# Altium project ArduinoMegaDevBoard.PrjPcb
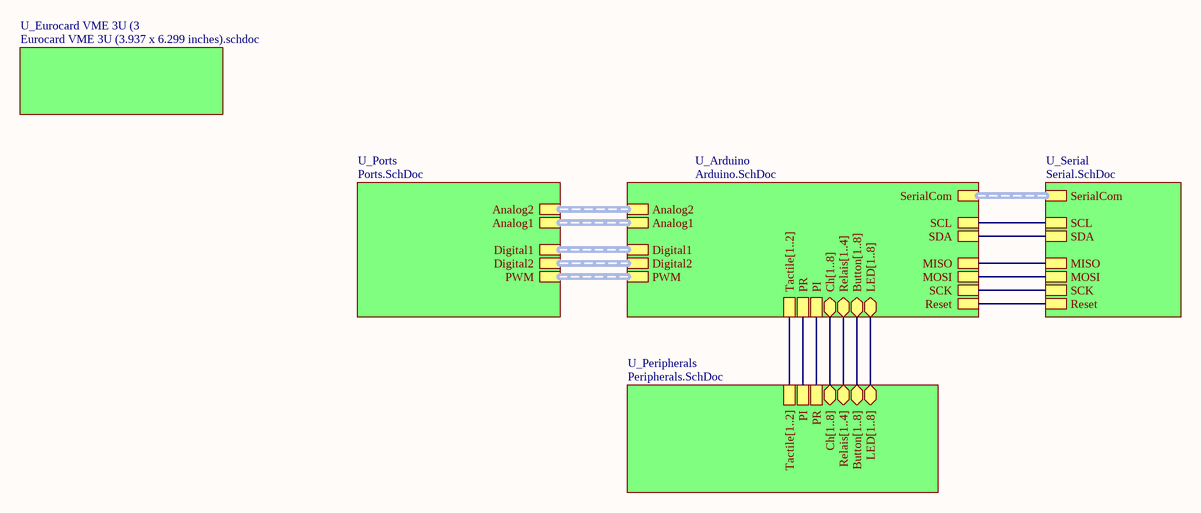
[diagram p0: TopSheet.SchDoc]
6 sheets, 87 parts. Net scope: hierarchical (ports join the sheet entries above them; power ports are global).
Board file: Eurocard VME 3U (3.937 x 6.299 inches).PCBDOC
Sheets:
  TopSheet.SchDoc
    U_Arduino = Arduino.SchDoc
    U_Serial = Serial.SchDoc
    U_Eurocard VME 3U (3 = Eurocard VME 3U (3.937 x 6.299 inches).schdoc
    U_Peripherals = Peripherals.SchDoc
    U_Ports = Ports.SchDoc

## Sheet TopSheet.SchDoc
size A4

### Sub-sheets
U_Arduino = Arduino.SchDoc: SerialCom (harness SerialMC), LED[1..8] (bidir), Button[1..8] (bidir), Relais[1..4] (bidir), PR, PI, Ch[1..8] (bidir), Reset, SCK, MISO, MOSI, Tactile[1..2], Digital1 (harness Digital1), Digital2 (harness Digital2), PWM (harness PWM), Analog2 (harness Analog2), Analog1 (harness Analog1), SCL, SDA
U_Eurocard VME 3U (3 = Eurocard VME 3U (3.937 x 6.299 inches).schdoc: no entries
U_Peripherals = Peripherals.SchDoc: LED[1..8] (bidir), Button[1..8] (bidir), Relais[1..4] (bidir), PI, PR, Ch[1..8] (bidir), Tactile[1..2]
U_Ports = Ports.SchDoc: PWM, Digital1, Digital2, Analog2 (harness Analog2), Analog1 (harness Analog1Port)
U_Serial = Serial.SchDoc: SerialCom (harness Serial3), MISO, Reset, SCK, MOSI, SCL, SDA

### Nets
PI: sheet U_Arduino/PI, sheet U_Peripherals/PR
PR: sheet U_Arduino/PR, sheet U_Peripherals/PI
Relais2: sheet U_Arduino/SCK, sheet U_Serial/SCK
Relais3: sheet U_Arduino/MOSI, sheet U_Serial/MOSI
Relais4: sheet U_Arduino/MISO, sheet U_Serial/MISO
Reset: sheet U_Arduino/Reset, sheet U_Serial/Reset
SCL: sheet U_Arduino/SCL, sheet U_Serial/SCL
SDA: sheet U_Arduino/SDA, sheet U_Serial/SDA

### Buses and harness runs
bus sheet U_Arduino/Button[1..8] = sheet U_Peripherals/Button[1..8]
bus sheet U_Arduino/Ch[1..8] = sheet U_Peripherals/Ch[1..8]
bus sheet U_Arduino/LED[1..8] = sheet U_Peripherals/LED[1..8]
bus sheet U_Arduino/Relais[1..4] = sheet U_Peripherals/Relais[1..4]
bus sheet U_Arduino/Tactile[1..2] = sheet U_Peripherals/Tactile[1..2]
harness sheet U_Arduino/Analog1 = sheet U_Ports/Analog1
harness sheet U_Arduino/Analog2 = sheet U_Ports/Analog2
harness sheet U_Arduino/Digital1 = sheet U_Ports/Digital1
harness sheet U_Arduino/Digital2 = sheet U_Ports/Digital2
harness sheet U_Arduino/PWM = sheet U_Ports/PWM
harness sheet U_Arduino/SerialCom = sheet U_Serial/SerialCom

## Sheet Arduino.SchDoc
size A4
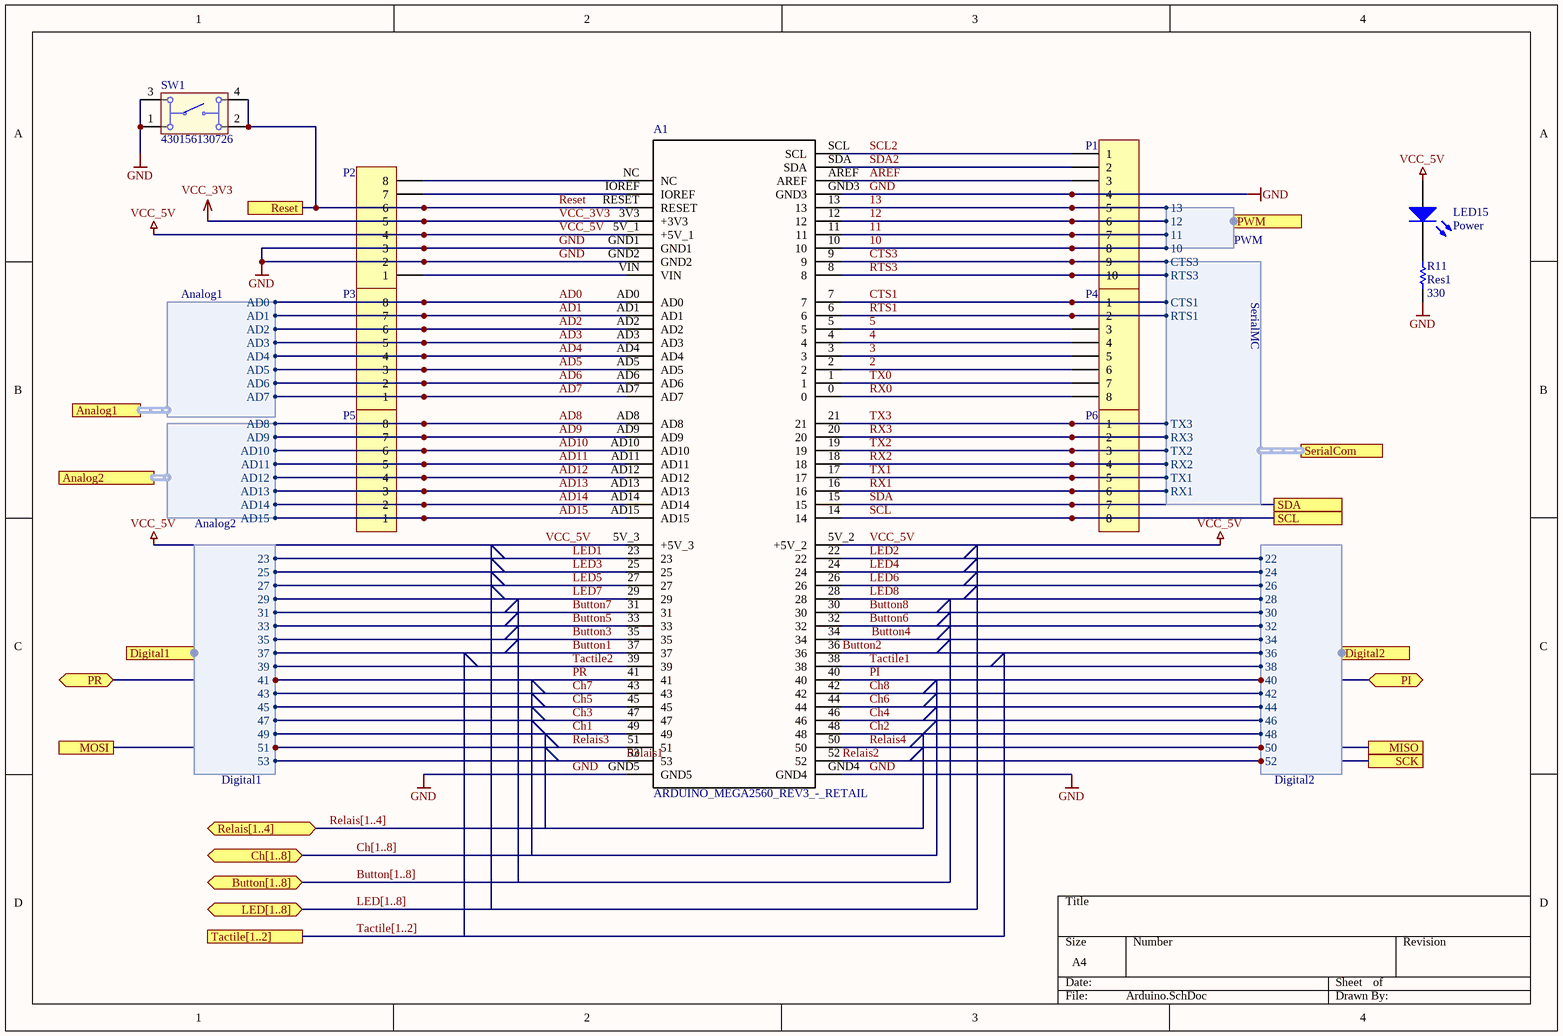
[diagram p1: Arduino.SchDoc]

### Parts
A1  ARDUINO_MEGA2560_REV3_-_RETAIL  [*ARDUINO_MEGA2560_REV3_-_RETAIL_ARDUINO_MEGA2560_REV3_-_RETAIL(Primary)]
LED15  Power  [Type 5mm]
P1  Header 10  [HDR1X10]  (value not drawn)
P2  Header 8  [HDR1X8]  (value not drawn)
P3  Header 8  [HDR1X8]  (value not drawn)
P4  Header 8  [HDR1X8]  (value not drawn)
P5  Header 8  [HDR1X8]  (value not drawn)
P6  Header 8  [HDR1X8]  (value not drawn)
R11  Res1  value 330  [AXIAL-0.3]
SW1  430156130726  [430156130726]

### Ports
Analog1 (harness Analog1), Analog2 (harness Analog2), Button[1..8] (bidir), Ch[1..8] (bidir), Digital1 (harness Digital1), Digital2 (harness Digital2), LED[1..8] (bidir), MISO, MOSI, PI (bidir), PR (bidir), PWM (harness PWM), Relais[1..4] (bidir), Reset, SCK, SCL, SDA, SerialCom (harness SerialMC), Tactile[1..2]

### Harnesses
SerialMC: TX3, RX3, TX2, RX2, TX1, RX1, CTS3, RTS3, CTS1, RTS1
Analog1: AD0, AD1, AD2, AD3, AD4, AD5, AD6, AD7
Digital1: 23, 25, 27, 29, 31, 33, 35, 37, 39, 41, 43, 45, 47, 49, 51, 53
Digital2: 22, 24, 26, 28, 30, 32, 34, 36, 38, 40, 42, 44, 46, 48, 50, 52
PWM: 10, 11, 12, 13
Analog2: AD8, AD9, AD10, AD11, AD12, AD13, AD14, AD15

### Nets
GND: A1.GND1 A1.GND2 A1.GND3 A1.GND4 A1.GND5 P1.4 P2.2 P2.3 R11.1 SW1.1 SW1.3
VCC_3V3: A1.3V3(+3V3) P2.5
VCC_5V: A1.5V_1(+5V_1) A1.5V_2(+5V_2) A1.5V_3(+5V_3) LED15.2(A) P2.4
2: A1.2 P4.6
3: A1.3 P4.5
4: A1.4 P4.4
5: A1.5 P4.3
10: A1.10 P1.8 ; port PWM.10
11: A1.11 P1.7 ; port PWM.11
12: A1.12 P1.6 ; port PWM.12
13: A1.13 P1.5 ; port PWM.13
AD0: A1.AD0 P3.8 ; port Analog1.AD0
AD1: A1.AD1 P3.7 ; port Analog1.AD1
AD2: A1.AD2 P3.6 ; port Analog1.AD2
AD3: A1.AD3 P3.5 ; port Analog1.AD3
AD4: A1.AD4 P3.4 ; port Analog1.AD4
AD5: A1.AD5 P3.3 ; port Analog1.AD5
AD6: A1.AD6 P3.2 ; port Analog1.AD6
AD7: A1.AD7 P3.1 ; port Analog1.AD7
AD8: A1.AD8 P5.8 ; port Analog2.AD8
AD9: A1.AD9 P5.7 ; port Analog2.AD9
AD10: A1.AD10 P5.6 ; port Analog2.AD10
AD11: A1.AD11 P5.5 ; port Analog2.AD11
AD12: A1.AD12 P5.4 ; port Analog2.AD12
AD13: A1.AD13 P5.3 ; port Analog2.AD13
AD14: A1.AD14 P5.2 ; port Analog2.AD14
AD15: A1.AD15 P5.1 ; port Analog2.AD15
AREF: A1.AREF P1.3
Button1: A1.37 ; port Digital1.37
Button2: A1.36 ; port Digital2.36
Button3: A1.35 ; port Digital1.35
Button4: A1.34 ; port Digital2.34
Button5: A1.33 ; port Digital1.33
Button6: A1.32 ; port Digital2.32
Button7: A1.31 ; port Digital1.31
Button8: A1.30 ; port Digital2.30
Ch1: A1.49 ; port Digital1.49
Ch2: A1.48 ; port Digital2.48
Ch3: A1.47 ; port Digital1.47
Ch4: A1.46 ; port Digital2.46
Ch5: A1.45 ; port Digital1.45
Ch6: A1.44 ; port Digital2.44
Ch7: A1.43 ; port Digital1.43
Ch8: A1.42 ; port Digital2.42
CTS1: A1.7 P4.1 ; port SerialCom.CTS1
CTS3: A1.9 P1.9 ; port SerialCom.CTS3
LED1: A1.23 ; port Digital1.23
LED2: A1.22 ; port Digital2.22
LED3: A1.25 ; port Digital1.25
LED4: A1.24 ; port Digital2.24
LED5: A1.27 ; port Digital1.27
LED6: A1.26 ; port Digital2.26
LED7: A1.29 ; port Digital1.29
LED8: A1.28 ; port Digital2.28
PI: A1.40 ; port PI, port Digital2.40
PR: A1.41 ; port PR, port Digital1.41
Relais1: A1.53 ; port Digital1.53
Relais2: A1.52 ; port SCK, port Digital2.52
Relais3: A1.51 ; port MOSI, port Digital1.51
Relais4: A1.50 ; port MISO, port Digital2.50
Reset: A1.RESET P2.6 SW1.2 SW1.4 ; port Reset
RTS1: A1.6 P4.2 ; port SerialCom.RTS1
RTS3: A1.8 P1.10 ; port SerialCom.RTS3
RX0: A1.0 P4.8
RX1: A1.16 P6.6 ; port SerialCom.RX1
RX2: A1.18 P6.4 ; port SerialCom.RX2
RX3: A1.20 P6.2 ; port SerialCom.RX3
SCL: A1.14 P6.8 ; port SCL
SCL2: A1.SCL P1.1
SDA: A1.15 P6.7 ; port SDA
SDA2: A1.SDA P1.2
Tactile1: A1.38 ; port Digital2.38
Tactile2: A1.39 ; port Digital1.39
TX0: A1.1 P4.7
TX1: A1.17 P6.5 ; port SerialCom.TX1
TX2: A1.19 P6.3 ; port SerialCom.TX2
TX3: A1.21 P6.1 ; port SerialCom.TX3
NetA1_IOREF: A1.IOREF P2.7
NetA1_NC: A1.NC P2.8
NetA1_VIN: A1.VIN P2.1
NetLED15_1: LED15.1(K) R11.2

### Buses and harness runs
bus Button[1..8] = port Button[1..8]
bus Ch[1..8] = port Ch[1..8]
bus LED[1..8] =  = port LED[1..8]
bus Relais[1..4] = port Relais[1..4]
bus Tactile[1..2] = port Tactile[1..2]

### Library data of the parts
A1 = ARDUINO_MEGA2560_REV3_-_RETAIL: Dev.kit: Arduino; SPI, TWI, UART; ICSP, USB B, pin strips, supply; MP: ARDUINO MEGA2560 REV3 - RETAIL; Price: None; MF: Arduino; Package: None; Availability: Unavailable; SnapEDA_Link: https://www.snapeda.com/parts/ARDUINO%20MEGA2560%20REV3%20-%20RETAIL/Arduino/view-part/?ref=snap; Value: *
LED15 = CMP-1489-00005-1: THT LED round mono-color waterclear, WL-TMRW, Green; PartNumber: 151053GS03000; Manufacturer: Wuerth Elektronik; ComponentLink2URL: http://katalog.we-online.de/pbs/datasheet/7448042001.pdfhttp://katalog.we-online.de/pbs/datasheet/7448042001.pdfhttp://katalog.we-online.de/pbs/datasheet/7448042001.pdfhttp://katalog.we-online.de/pbs/datasheet/151053GS03000.pdf; ComponentLink2Description: Datasheet; ComponentLink1URL: http://www.we-online.com; PackageReference: Type 5mm; ComponentLink1Description: Manufacturer URL; Emitting color: Green
P1 = Header 10: Header, 10-Pin; LatestRevisionDate: 17-Jul-2002; LatestRevisionNote: Re-released for DXP Platform.; Publisher: Altium Limited
P2-P6 = Header 8: Header, 8-Pin; LatestRevisionDate: 17-Jul-2002; LatestRevisionNote: Re-released for DXP Platform.; Publisher: Altium Limited
R11 = Res1: Resistor; Published: 8-Jun-2000; LatestRevisionDate: 17-Jul-2002; LatestRevisionNote: Re-released for DXP Platform.; PackageReference: AXIAL-0.3; Publisher: Altium Limited; PackageDescription: Axial Device, Thru-Hole; 2 Leads; 0.3 in Pin Spacing
SW1 = CMP-1453-00009-1: WS-TATV THT Tact Switch 6X6 mm; Manufacturer: Wuerth Elektronik; NoPins: 04; PartNumber: 430156130726; ComponentLink1Description: Manufacturer URL; ComponentLink1URL: http://www.we-online.com; ComponentLink2Description: Datasheet; ComponentLink2URL: http://katalog.we-online.de/em/datasheet/4301x6.pdf; PackageReference: 430156130726

## Sheet Serial.SchDoc
size A4
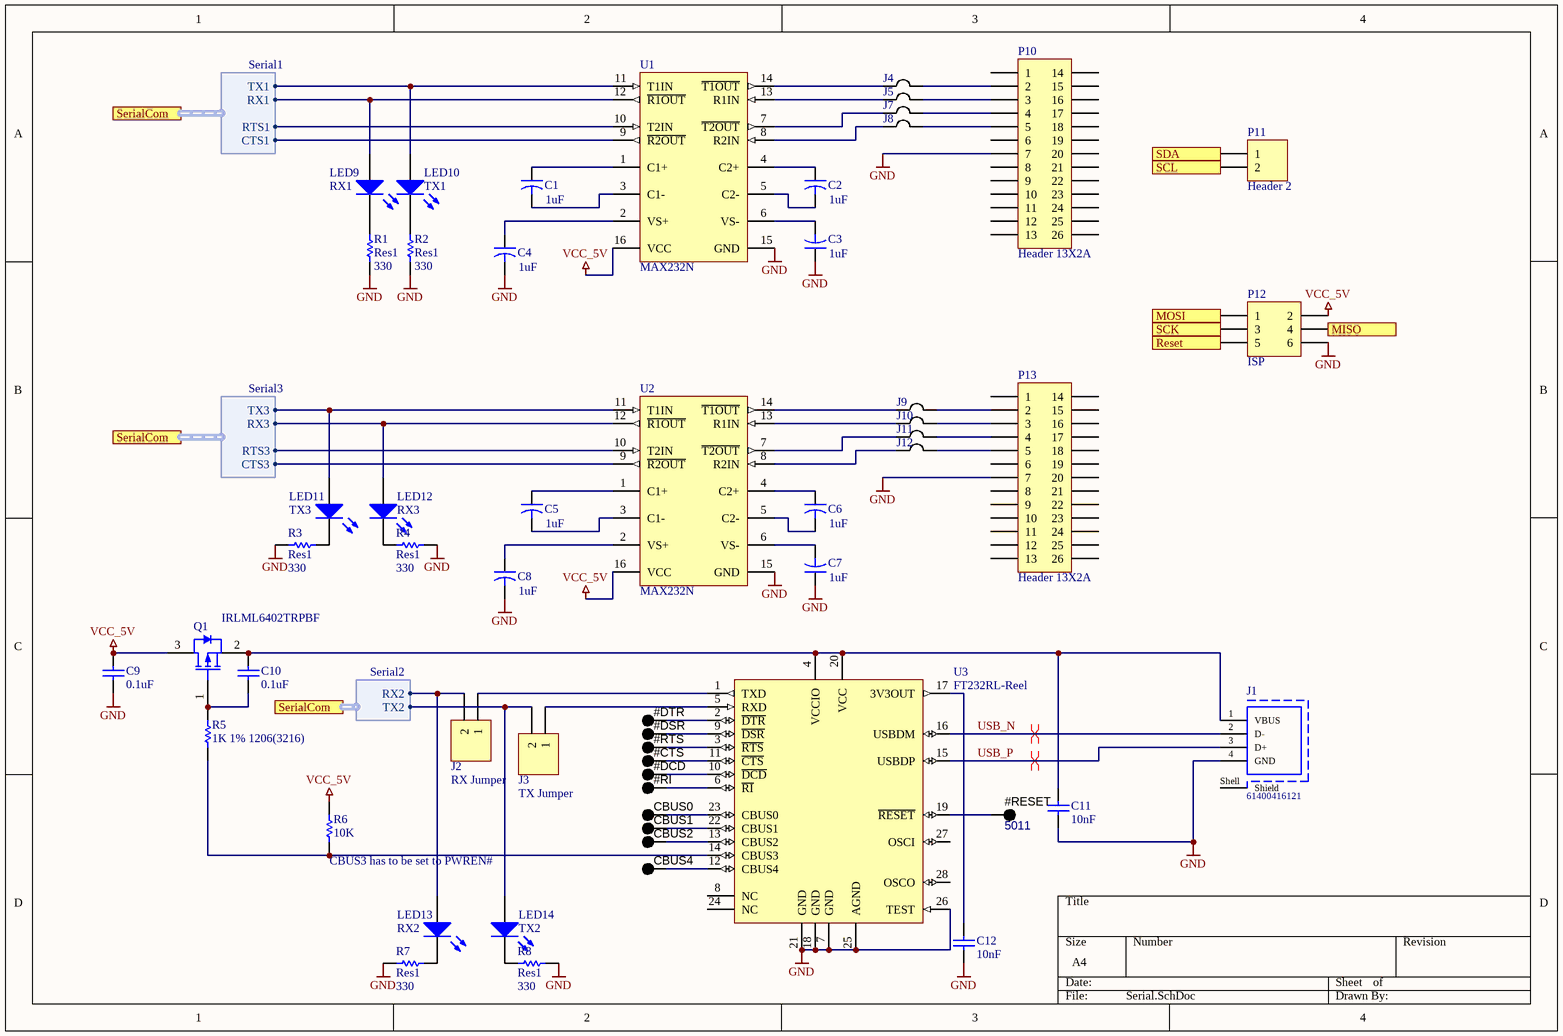
[diagram p2: Serial.SchDoc]

### Parts
(Parts that share a designator on the sheet are numbered #1, #2 ... from top to bottom, then left to right.)
#CTS  5011  [KSTN-5011_V]  (value not drawn)
#DCD  5011  [KSTN-5011_V]  (value not drawn)
#DSR  5011  [KSTN-5011_V]  (value not drawn)
#DTR  5011  [KSTN-5011_V]  (value not drawn)
#RESET  5011  [KSTN-5011_V]
#RI  5011  [KSTN-5011_V]  (value not drawn)
#RTS  5011  [KSTN-5011_V]  (value not drawn)
C1  value 1uF  [CAPR5-4X5]  (hidden comment: Cap2)
C2  value 1uF  [CAPR5-4X5]  (hidden comment: Cap2)
C3  value 1uF  [CAPR5-4X5]  (hidden comment: Cap2)
C4  value 1uF  [CAPR5-4X5]  (hidden comment: Cap2)
C5  value 1uF  [CAPR5-4X5]  (hidden comment: Cap2)
C6  value 1uF  [CAPR5-4X5]  (hidden comment: Cap2)
C7  value 1uF  [CAPR5-4X5]  (hidden comment: Cap2)
C8  value 1uF  [CAPR5-4X5]  (hidden comment: Cap2)
C9  0.1uF  [CAPC1206(3216)130_L]
C10  0.1uF  [CAPC1206(3216)130_L]
C11  10nF  [CAPC1206(3216)130_M]
C12  10nF  [CAPC1206(3216)130_M]
CBUS0  5011  [KSTN-5011_V]  (value not drawn)
CBUS1  5011  [KSTN-5011_V]  (value not drawn)
CBUS2  5011  [KSTN-5011_V]  (value not drawn)
CBUS4  5011  [KSTN-5011_V]  (value not drawn)
J1  61400416121  [61400416121]
J2  RX Jumper  [HDR1X2]
J3  TX Jumper  [HDR1X2]
J4#1  Jumper  [SMDJumper]  (value not drawn)
J5#1  Jumper  [SMDJumper]  (value not drawn)
J7  Jumper  [SMDJumper]  (value not drawn)
J8  Jumper  [SMDJumper]  (value not drawn)
J9  Jumper  [SMDJumper]  (value not drawn)
J10  Jumper  [SMDJumper]  (value not drawn)
J11  Jumper  [SMDJumper]  (value not drawn)
J12  Jumper  [SMDJumper]  (value not drawn)
LED9  RX1  [Type 3mm]
LED10  TX1  [Type 3mm]
LED11  TX3  [Type 3mm]
LED12  RX3  [Type 3mm]
LED13  RX2  [Type 3mm]
LED14  TX2  [Type 3mm]
P10  Header 13X2A  [HDR2X13_CEN]
P11  Header 2  [HDR1X2]
P12  ISP  [HDR2X3]
P13  Header 13X2A  [HDR2X13_CEN]
Q1  IRLML6402TRPBF  [INTR-SOT-23-3_V]
R1  Res1  value 330  [AXIAL-0.3]
R2  Res1  value 330  [AXIAL-0.3]
R3  Res1  value 330  [AXIAL-0.3]
R4  Res1  value 330  [AXIAL-0.3]
R5  1K 1% 1206(3216)  [RESC1206(3216)_N]
R6  10K  [RESC1206(3216)_M]
R7  Res1  value 330  [AXIAL-0.3]
R8  Res1  value 330  [AXIAL-0.3]
U1  MAX232N  [N0016A]
U2  MAX232N  [N0016A]
U3  FT232RL-Reel  [SSOP-28_M]

### Ports
MISO, MOSI, Reset, SCK, SCL, SDA, SerialCom (harness Serial1), SerialCom (harness Serial2), SerialCom (harness Serial3)

### Harnesses
Serial1: TX1, RX1, CTS1, RTS1
Serial2: TX2, RX2
Serial3: TX3, RX3, CTS3, RTS3

### Nets
GND: C3.1 C4.2 C7.1 C8.2 C9.2 C11.1 C12.1 J1.4(GND) P10.7 P12.6 P13.7 R1.1 R2.1 R3.1 R4.2 R7.1 R8.2 U1.15(GND) U2.15(GND) U3.7(GND) U3.18(GND) U3.21(GND) U3.25(AGND) U3.26(TEST)
VCC_5V: C9.1 P12.2 Q1.3(DRAIN) R6.2 U1.16(VCC) U2.16(VCC)
CTS1: U1.9(~{R2OUT}) ; port SerialCom.CTS1
CTS3: U2.9(~{R2OUT}) ; port SerialCom.CTS3
Relais2: P12.3 ; port SCK
Relais3: P12.1 ; port MOSI
Relais4: P12.4 ; port MISO
Reset: P12.5 ; port Reset
RTS1: U1.10(T2IN) ; port SerialCom.RTS1
RTS3: U2.10(T2IN) ; port SerialCom.RTS3
RX1: LED9.2(A) U1.12(~{R1OUT}) ; port SerialCom.RX1
RX2: J2.2 LED13.2(A) ; port SerialCom.RX2
RX3: LED12.2(A) U2.12(~{R1OUT}) ; port SerialCom.RX3
SCL: P11.2 ; port SCL
SDA: P11.1 ; port SDA
TX1: LED10.2(A) U1.11(T1IN) ; port SerialCom.TX1
TX2: J3.2 LED14.2(A) ; port SerialCom.TX2
TX3: LED11.2(A) U2.11(T1IN) ; port SerialCom.TX3
USB_N: J1.2(D-) U3.16(USBDM)
USB_P: J1.3(D+) U3.15(USBDP)
Net#CTS_1: #CTS.1 U3.11(~{CTS})
Net#DCD_1: #DCD.1 U3.10(~{DCD})
Net#DSR_1: #DSR.1 U3.9(~{DSR})
Net#DTR_1: #DTR.1 U3.2(~{DTR})
Net#RESET_1: #RESET.1 U3.19(~{RESET})
Net#RI_1: #RI.1 U3.6(~{RI})
Net#RTS_1: #RTS.1 U3.3(~{RTS})
NetC1_1: C1.1 U1.1(C1+)
NetC1_2: C1.2 U1.3(C1-)
NetC2_1: C2.1 U1.4(C2+)
NetC2_2: C2.2 U1.5(C2-)
NetC3_2: C3.2 U1.6(VS-)
NetC4_1: C4.1 U1.2(VS+)
NetC5_1: C5.1 U2.1(C1+)
NetC5_2: C5.2 U2.3(C1-)
NetC6_1: C6.1 U2.4(C2+)
NetC6_2: C6.2 U2.5(C2-)
NetC7_2: C7.2 U2.6(VS-)
NetC8_1: C8.1 U2.2(VS+)
NetC10_1: C10.1 C11.2 J1.1(VBUS) Q1.2(SOURCE) U3.4(VCCIO) U3.20(VCC)
NetC10_2: C10.2 Q1.1(GATE) R5.2
NetC12_2: C12.2 U3.17(3V3OUT)
NetCBUS0_1: CBUS0.1 U3.23(CBUS0)
NetCBUS1_1: CBUS1.1 U3.22(CBUS1)
NetCBUS2_1: CBUS2.1 U3.13(CBUS2)
NetCBUS4_1: CBUS4.1 U3.12(CBUS4)
NetJ2_1: J2.1 U3.1(TXD)
NetJ3_1: J3.1 U3.5(RXD)
NetJ4#1_1: J4#1.1 U1.14(~{T1OUT})
NetJ4#1_2: J4#1.2 P10.2
NetJ5#1_1: J5#1.1 U1.13(R1IN)
NetJ5#1_2: J5#1.2 P10.3
NetJ7_1: J7.1 U1.7(~{T2OUT})
NetJ7_2: J7.2 P10.4
NetJ8_1: J8.1 U1.8(R2IN)
NetJ8_2: J8.2 P10.5
NetJ9_1: J9.1 U2.14(~{T1OUT})
NetJ9_2: J9.2 P13.2
NetJ10_1: J10.1 U2.13(R1IN)
NetJ10_2: J10.2 P13.3
NetJ11_1: J11.1 U2.7(~{T2OUT})
NetJ11_2: J11.2 P13.4
NetJ12_1: J12.1 U2.8(R2IN)
NetJ12_2: J12.2 P13.5
NetLED9_1: LED9.1(K) R1.2
NetLED10_1: LED10.1(K) R2.2
NetLED11_1: LED11.1(K) R3.2
NetLED12_1: LED12.1(K) R4.1
NetLED13_1: LED13.1(K) R7.2
NetLED14_1: LED14.1(K) R8.1
NetR5_1: R5.1 R6.1 U3.14(CBUS3)

Not connected (* = marked no-connect by the designer): J1 Shell(Shield); P10 1 6 8 9 10 11 12 13 14 15 16 17 18 19 20 21 22 23 24 25 26; P13 1 6 8 9 10 11 12 13 14 15 16 17 18 19 20 21 22 23 24 25 26; U3 8(NC) 24(NC) 27(OSCI) 28(OSCO)

### Layout directives
differential pair; net class USB_N: USB_N
differential pair: USB_P

### Notes on the sheet
- (near R6) CBUS3 has to be set to PWREN#

### Library data of the parts
#CTS #DCD #DSR #DTR #RESET #RI #RTS CBUS0-CBUS2 CBUS4 = CMP-1672-00003-3: Test Point, Black, Through Hole, RoHS, Bulk; Contact Plating: Silver; Packaging: Bulk; Package Quantity: 100; REACH SVHC: No SVHC; PackageDescription: 1-Pin Through Hole Device, Dia 3.17 mm; PackageReference: 5011; Colour: Black; Mount: Through Hole; Mounting Technology: Through Hole; Pins: 1; RoHSCompliant: true; Height: 8.12 mm; Contact Material: Bronze; DatasheetVersion: Rev. F, 12/2013
C1-C8 = Cap2: Capacitor; Published: 23-Sep-2002; PackageReference: CAPR5-4X5; Publisher: Altium Limited; PackageDescription: Capacitor; 2 Leads
C9-C12 = CMP-1037-03460-1: CAP 10nF 16V ±1% 1206 (3216 Metric) Thickness 1.3mm SMD; Case-Metric: 3216; Tolerance: Â±1%; Case-EIA: 1206; Max Thickness: 1.3 mm; Technology: SMT; Rated Voltage: 16 V
  C9 C10: Value: 0.1uF
  C11 C12: Value: 10nF
J1 = CMP-1502-03243-1: USB 2.0 Type B Receptacle WR-COM, Horizontal, THT, with Pads and Pegs; Manufacturer: Wurth Elektronik; Contact Resistance: 20mOhm; Rated Current: 1.5A; Working Voltage: 30VAC; Package Reference: 61400416121; Part Number: 61400416121; Packaging: Tray; Mounting Technology: THT; Gender: Receptacle; Datasheet URL: https://katalog.we-online.de/em/datasheet/61400416121.pdf; Publisher: WurthElektronik; Orientation: Horizontal; Connector Type: USB2.0TypeB; Operating Temperature: -40to105degC; Manufacturer URL: http://www.we-online.de
J2 J3 P11 = Header 2: Header, 2-Pin; LatestRevisionDate: 17-Jul-2002; LatestRevisionNote: Re-released for DXP Platform.; Publisher: Altium Limited
LED9-LED14 = CMP-1489-00003-1: THT LED round mono-color waterclear, WL-TMRW, Yellow; Manufacturer: Wuerth Elektronik; PartNumber: 151033YS03000; ComponentLink2Description: Datasheet; ComponentLink1Description: Manufacturer URL; Emitting color: Yellow; ComponentLink2URL: http://katalog.we-online.de/pbs/datasheet/7448042001.pdfhttp://katalog.we-online.de/pbs/datasheet/7448042001.pdfhttp://katalog.we-online.de/pbs/datasheet/7448042001.pdfhttp://katalog.we-online.de/pbs/datasheet/151033YS03000.pdf; ComponentLink1URL: http://www.we-online.com; PackageReference: Type 3mm
P10 P13 = Header 13X2A: Header, 13-Pin, Dual row; LatestRevisionDate: 17-Jul-2002; LatestRevisionNote: Re-released for DXP Platform.; Publisher: Altium Limited
P12 = Header 3X2: Header, 3-Pin, Dual row; LatestRevisionDate: 17-Jul-2002; LatestRevisionNote: Re-released for DXP Platform.; Publisher: Altium Limited
Q1 = CMP-2000-04987-1: HEXFET(R) Power P-Channel MOSFET, -20 V, -3.7 A, -55 to 150 degC, 3-Pin SOT-23, RoHS, Tape and Reel; Manufacturer: International Rectifier; Drain-to-Source Voltage [Vdss]: 20V; Rated Power Dissipation: 1.3W; Qg Gate Charge: 8nC; Drain-Source On Resistance-Max: 0.065O; Channel Type: P-Channel; Package Reference: SOT-23-3; Manufacturer URL: http://internationalrectifier.com/; Datasheet URL: http://datasheet.octopart.com/IRLML6402TRPBF-International-Rectifier-datasheet-93882.pdf; Datasheet Version: Feb-05; Package Description: 3-Pin Small Outline Transistor, Body 2.92 x 1.3 mm, Pitch 0.95 mm
R1-R4 R7 R8 = Res1: Resistor; Published: 8-Jun-2000; LatestRevisionDate: 17-Jul-2002; LatestRevisionNote: Re-released for DXP Platform.; PackageReference: AXIAL-0.3; Publisher: Altium Limited; PackageDescription: Axial Device, Thru-Hole; 2 Leads; 0.3 in Pin Spacing
R5 = CMP-1014-00510-1: 1K 0.25W 1% 1206 (3216 Metric)  SMD; Case-Metric: 3216; Case-EIA: 1206; Value: 1000.00 Ohm; Power: 0.25 W; Tolerance: 1 %; Technology: SMT
R6 = CMP-1014-00098-1: 10K 0.25W 5% 1206 (3216 Metric)  SMD; Value: 10000.00 Ohm; Case-Metric: 3216; Case-EIA: 1206; Power: 0.25 W; Tolerance: 5 %; Technology: SMT
U1 U2 = CMP-0299-00084-2: Dual EIA-232 Driver / Receiver, 0 to 70 degC, 16-Pin PDIP (N), Pb-Free (RoHS); Single Supply: TRUE; ICC(Max)(mA): 10; SubFamily: RS-232; Supply Voltage(s)(V): 5; ESD HBM(kV): +/-2; Receivers Per Package: 2; ComponentLink1Description: Manufacturer URL; PackageDescription: 16-Pin Plastic Dual-In-Line Package, Row Spacing 7.62 mm, Pitch 2.54 mm; ComponentLink3Description: Package Specification; DatasheetVersion: SLLS047L; ComponentLink2URL: http://www.ti.com/general/docs/lit/getliterature.tsp?genericPartNumber=MAX232&fileType=pdf; RS-232: TRUE; ComponentLink3URL: http://www.ti.com/litv/pdf/mpdi002c; PackageReference: N0016A; PackageVersion: revE, Dec-2002; ComponentLink1URL: www.ti.com; Drivers Per Package: 2; ComponentLink2Description: Datasheet
U3 = CMP-0078-00029-3: USB UART Asynchronous Serial Data Transfer Chip, 28-pin SSOP, Tape and Reel; Manufacturer: FTDI; PackageVersion: Mar-12; PackageReference: SSOP-28; ComponentLink2Description: Datasheet; DatasheetVersion: ver 2.10, Mar-2012; PackageDescription: 28-Pin Small Outline Package 0.65 mm Pitch; ComponentLink1Description: Manufacturer URL; RevisionNote: DatasheetVersion updated to 2.10 Mar-2012; PartNumber: FT232RL-Reel; ComponentLink1URL: http://www.ftdichip.com/; ComponentLink2URL: http://www.ftdichip.com/Support/Documents/DataSheets/ICs/DS_FT232R.pdf

## Sheet Eurocard VME 3U (3.937 x 6.299 inches).schdoc: Eurocard VME 3U (3.937 x 6.299 inches)
size A; Organization: Organization; Address1: Address1; Address2: Address2; Address3: Address3; Address4: Address4; DocumentNumber: 1; Revision: 0; SheetNumber: 2; SheetTotal: 2
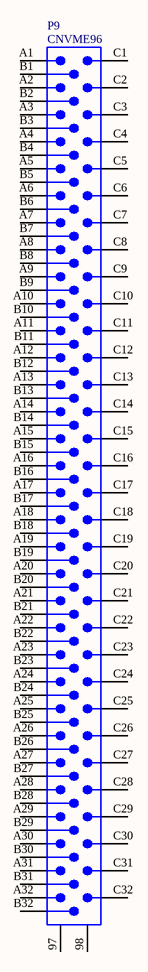
[diagram p3: Eurocard VME 3U (3.937 x 6.299 inches).schdoc]

### Parts
P9  CNVME96  [CNVME96]

### Nets

Not connected (* = marked no-connect by the designer): P9 97 98 A1 A2 A3 A4 A5 A6 A7 A8 A9 A10 A11 A12 A13 A14 A15 A16 A17 A18 A19 A20 A21 A22 A23 A24 A25 A26 A27 A28 A29 A30 A31 A32 B1 B2 B3 B4 B5 B6 B7 B8 B9 B10 B11 B12 B13 B14 B15 B16 B17 B18 B19 B20 B21 B22 B23 B24 B25 B26 B27 B28 B29 B30 B31 B32 C1 C2 C3 C4 C5 C6 C7 C8 C9 C10 C11 C12 C13 C14 C15 C16 C17 C18 C19 C20 C21 C22 C23 C24 C25 C26 C27 C28 C29 C30 C31 C32

### Library data of the parts
P9 = CNVME96: 96-Pin Connector (3x32 2.54mm grid); Text Field6: Alternate Layout Available; Text Field7: Published 14-Feb-2002

## Sheet Peripherals.SchDoc
size A4
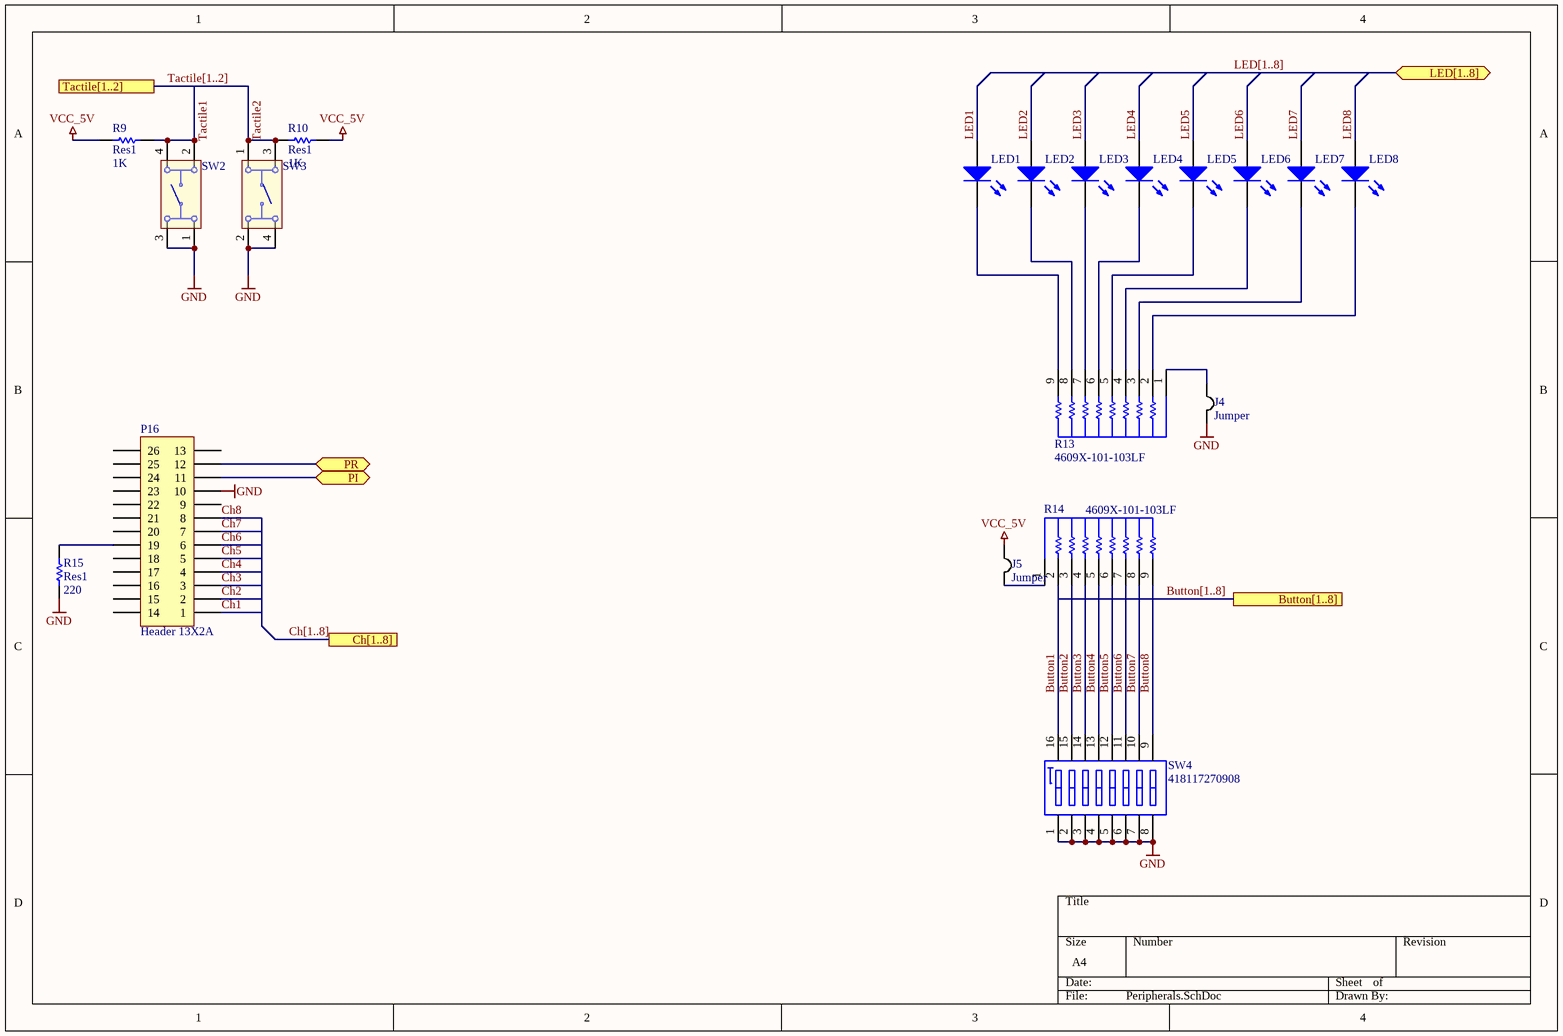
[diagram p4: Peripherals.SchDoc]

### Parts
(Parts that share a designator on the sheet are numbered #1, #2 ... from top to bottom, then left to right.)
J4#2  Jumper  [SMDJumper]
J5#2  Jumper  [SMDJumper]
LED1  TX1  [Type 3mm]  (value not drawn)
LED2  TX1  [Type 3mm]  (value not drawn)
LED3  TX1  [Type 3mm]  (value not drawn)
LED4  TX1  [Type 3mm]  (value not drawn)
LED5  TX1  [Type 3mm]  (value not drawn)
LED6  TX1  [Type 3mm]  (value not drawn)
LED7  TX1  [Type 3mm]  (value not drawn)
LED8  TX1  [Type 3mm]  (value not drawn)
P16  Header 13X2A  [HDR2X13_CEN]
R9  Res1  value 1K  [AXIAL-0.3]
R10  Res1  value 1K  [AXIAL-0.3]
R13  4609X-101-103LF  [BOUR-4609X]
R14  4609X-101-103LF  [BOUR-4609X]
R15  Res1  value 220  [AXIAL-0.3]
SW2  430156130726  [430156130726]  (value not drawn)
SW3  430156130726  [430156130726]  (value not drawn)
SW4  418117270908  [418117270908]

### Ports
Button[1..8], Ch[1..8], LED[1..8] (bidir), PI (bidir), PR (bidir), Tactile[1..2]

### Nets
GND: J4#2.2 P16.10 R15.1 SW2.1 SW2.3 SW3.2 SW3.4 SW4.1 SW4.2 SW4.3 SW4.4 SW4.5 SW4.6 SW4.7 SW4.8
VCC_5V: J5#2.1 R9.1 R10.2
Button1: R14.2 SW4.16
Button2: R14.3 SW4.15
Button3: R14.4 SW4.14
Button4: R14.5 SW4.13
Button5: R14.6 SW4.12
Button6: R14.7 SW4.11
Button7: R14.8 SW4.10
Button8: R14.9 SW4.9
Ch1: P16.1
Ch2: P16.2
Ch3: P16.3
Ch4: P16.4
Ch5: P16.5
Ch6: P16.6
Ch7: P16.7
Ch8: P16.8
LED1: LED1.2(A)
LED2: LED2.2(A)
LED3: LED3.2(A)
LED4: LED4.2(A)
LED5: LED5.2(A)
LED6: LED6.2(A)
LED7: LED7.2(A)
LED8: LED8.2(A)
PI: P16.12 ; port PR
PR: P16.11 ; port PI
Tactile1: R9.2 SW2.2 SW2.4
Tactile2: R10.1 SW3.1 SW3.3
NetJ4#2_1: J4#2.1 R13.1
NetJ5#2_2: J5#2.2 R14.1
NetLED1_1: LED1.1(K) R13.9
NetLED2_1: LED2.1(K) R13.8
NetLED3_1: LED3.1(K) R13.7
NetLED4_1: LED4.1(K) R13.6
NetLED5_1: LED5.1(K) R13.5
NetLED6_1: LED6.1(K) R13.4
NetLED7_1: LED7.1(K) R13.3
NetLED8_1: LED8.1(K) R13.2
NetP16_19: P16.19 R15.2

Not connected (* = marked no-connect by the designer): P16 9 13 14 15 16 17 18 20 21 22 23 24 25 26

### Buses and harness runs
bus Button[1..8] = port Button[1..8]
bus Ch[1..8] = port Ch[1..8]
bus LED[1..8] = port LED[1..8]
bus Tactile[1..2] = port Tactile[1..2]

### Library data of the parts
LED1-LED8 = CMP-1489-00003-1: as LED9 on sheet Serial; ComponentLink2Description: Datasheet; ComponentLink1Description: Manufacturer URL; Emitting color: Yellow; ComponentLink2URL: http://katalog.we-online.de/pbs/datasheet/7448042001.pdfhttp://katalog.we-online.de/pbs/datasheet/7448042001.pdfhttp://katalog.we-online.de/pbs/datasheet/7448042001.pdfhttp://katalog.we-online.de/pbs/datasheet/151033YS03000.pdf; ComponentLink1URL: http://www.we-online.com; PackageReference: Type 3mm
P16 = Header 13X2A: Header, 13-Pin, Dual row; LatestRevisionDate: 17-Jul-2002; LatestRevisionNote: Re-released for DXP Platform.; Publisher: Altium Limited
R9 R10 R15 = Res1: Resistor; Published: 8-Jun-2000; LatestRevisionDate: 17-Jul-2002; LatestRevisionNote: Re-released for DXP Platform.; PackageReference: AXIAL-0.3; Publisher: Altium Limited; PackageDescription: Axial Device, Thru-Hole; 2 Leads; 0.3 in Pin Spacing
R13 R14 = CMP-2000-05605-1: Resistor, Network, 1.13 W, 10 kOhm, -55 to 125 degC, 9-Pin THD, RoHS, Bulk; Manufacturer: Bourns; Tolerance: ±2%; Power, Rating: 1.13W; Resistance: 10kilohms; Temperature, Operating: -55to+125°C; Brand/Series: 4600XSeries; Circuit: BussedArray; Number of Resistors: 8; Package Type: SIP; Dimensions: 0.898x0.098x0.2(22.81x2.49x5.08)LxWxHin.(mm); Package Reference: 4609X; Mounting Technology: ThroughHole; Package Description: 9-Pin Through Hole Device, Body 22.81 x 2.49 mm, Pitch 2.54 mm; Number of Terminals: 9; Datasheet URL: https://datasheet.ciiva.com/11807/0900766b8069ccfd-11807021.pdf; Datasheet Version: 04/2010; Manufacturer URL: http://www.bourns.com/; Mounting Type: ThroughHole
SW2 SW3 = CMP-1453-00009-1: as SW1 on sheet Arduino; PartNumber: 430156130726; ComponentLink1Description: Manufacturer URL; ComponentLink1URL: http://www.we-online.com; ComponentLink2Description: Datasheet; ComponentLink2URL: http://katalog.we-online.de/em/datasheet/4301x6.pdf; PackageReference: 430156130726
SW4 = CMP-1435-00007-1: WS-DITV 2.54 mm Compact THT Dip Switch with Raised Actuator; Manufacturer: Wuerth Elektronik; NoPins: 16; ComponentLink2URL: http://katalog.we-online.de/em/datasheet/4181172709xx.pdf; ComponentLink1Description: Manufacturer URL; ComponentLink1URL: http://www.we-online.com; ComponentLink2Description: Datasheet; PackageReference: 418117270908; PartNumber: 418117270908

## Sheet Ports.SchDoc
size A4
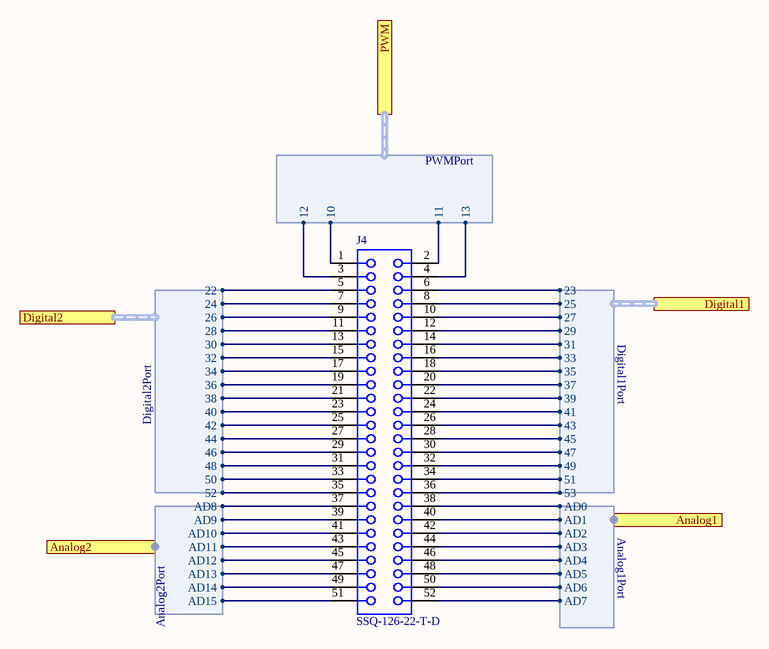
[diagram p5: Ports.SchDoc]

### Parts
(Parts that share a designator on the sheet are numbered #1, #2 ... from top to bottom, then left to right.)
J4#3  SSQ-126-22-T-D  [SMTC-SSQ-126-22-X-D]

### Ports
Analog1 (harness Analog1Port), Analog2 (harness Analog2Port), Digital1 (harness Digital1Port), Digital2 (harness Digital2Port), PWM (harness PWMPort)

### Harnesses
Digital2Port: 22, 24, 26, 28, 30, 32, 34, 36, 38, 40, 42, 44, 46, 48, 50, 52
Digital1Port: 23, 25, 27, 29, 31, 33, 35, 37, 39, 41, 43, 45, 47, 49, 51, 53
PWMPort: 10, 11, 12, 13
Analog1Port: AD0, AD1, AD2, AD3, AD4, AD5, AD6, AD7
Analog2Port: AD8, AD9, AD10, AD11, AD12, AD13, AD14, AD15

### Nets
10: J4#3.1 ; port PWM.10
11: J4#3.2 ; port PWM.11
12: J4#3.3 ; port PWM.12
13: J4#3.4 ; port PWM.13
AD0: J4#3.38 ; port Analog1.AD0
AD1: J4#3.40 ; port Analog1.AD1
AD2: J4#3.42 ; port Analog1.AD2
AD3: J4#3.44 ; port Analog1.AD3
AD4: J4#3.46 ; port Analog1.AD4
AD5: J4#3.48 ; port Analog1.AD5
AD6: J4#3.50 ; port Analog1.AD6
AD7: J4#3.52 ; port Analog1.AD7
AD8: J4#3.37 ; port Analog2.AD8
AD9: J4#3.39 ; port Analog2.AD9
AD10: J4#3.41 ; port Analog2.AD10
AD11: J4#3.43 ; port Analog2.AD11
AD12: J4#3.45 ; port Analog2.AD12
AD13: J4#3.47 ; port Analog2.AD13
AD14: J4#3.49 ; port Analog2.AD14
AD15: J4#3.51 ; port Analog2.AD15
Button1: J4#3.20 ; port Digital1.37
Button2: J4#3.19 ; port Digital2.36
Button3: J4#3.18 ; port Digital1.35
Button4: J4#3.17 ; port Digital2.34
Button5: J4#3.16 ; port Digital1.33
Button6: J4#3.15 ; port Digital2.32
Button7: J4#3.14 ; port Digital1.31
Button8: J4#3.13 ; port Digital2.30
Ch1: J4#3.32 ; port Digital1.49
Ch2: J4#3.31 ; port Digital2.48
Ch3: J4#3.30 ; port Digital1.47
Ch4: J4#3.29 ; port Digital2.46
Ch5: J4#3.28 ; port Digital1.45
Ch6: J4#3.27 ; port Digital2.44
Ch7: J4#3.26 ; port Digital1.43
Ch8: J4#3.25 ; port Digital2.42
LED1: J4#3.6 ; port Digital1.23
LED2: J4#3.5 ; port Digital2.22
LED3: J4#3.8 ; port Digital1.25
LED4: J4#3.7 ; port Digital2.24
LED5: J4#3.10 ; port Digital1.27
LED6: J4#3.9 ; port Digital2.26
LED7: J4#3.12 ; port Digital1.29
LED8: J4#3.11 ; port Digital2.28
PI: J4#3.23 ; port Digital2.40
PR: J4#3.24 ; port Digital1.41
Relais1: J4#3.36 ; port Digital1.53
Relais2: J4#3.35 ; port Digital2.52
Relais3: J4#3.34 ; port Digital1.51
Relais4: J4#3.33 ; port Digital2.50
Tactile1: J4#3.21 ; port Digital2.38
Tactile2: J4#3.22 ; port Digital1.39

### Library data of the parts
J4#3 = CMP-1023-00318-1: SQ Post Socket, Through-hole, Vertical, -55 to 105 degC, 2.54 mm Pitch, 52-Pin, Female, RoHS; Manufacturer: Samtec; Pitch: 2.54 mm; ComponentLink1Description: Manufacturer URL; PartNumber: SSQ-126-22-T-D; PackageDescription: Assembly, Socket Strip .025[0.64] SQ Tail; ComponentLink3Description: Package Specification; DatasheetVersion: F-214; ComponentLink2Description: Datasheet; PackageReference: SSQ-126-22-X-D; PackageVersion: BD, 6/1987; ComponentLink1URL: http://www.samtec.com; Mounting Technology: Through-hole; Orientation: Vertical; ComponentLink3URL: http://www.samtec.com/documents/webfiles/cpdf/SSQ-1XX-XX-XXX-X-XX-XXX-XX-X-MKT.pdf; Temperature Range: -55 to 105 degC; ComponentLink2URL: http://www.samtec.com/documents/webfiles/pdf/SSQ_TH.PDF; RoHS: True

## Nets that join several sheets
GND: Arduino (11 pins), Serial (24 pins), Peripherals (15 pins)
VCC_5V: Arduino (5 pins), Serial (6 pins), Peripherals (J5#2.1 R9.1 R10.2)
10: Arduino (A1.10 P1.8), Ports (J4#3.1)
11: Arduino (A1.11 P1.7), Ports (J4#3.2)
12: Arduino (A1.12 P1.6), Ports (J4#3.3)
13: Arduino (A1.13 P1.5), Ports (J4#3.4)
AD0: Arduino (A1.AD0 P3.8), Ports (J4#3.38)
AD1: Arduino (A1.AD1 P3.7), Ports (J4#3.40)
AD2: Arduino (A1.AD2 P3.6), Ports (J4#3.42)
AD3: Arduino (A1.AD3 P3.5), Ports (J4#3.44)
AD4: Arduino (A1.AD4 P3.4), Ports (J4#3.46)
AD5: Arduino (A1.AD5 P3.3), Ports (J4#3.48)
AD6: Arduino (A1.AD6 P3.2), Ports (J4#3.50)
AD7: Arduino (A1.AD7 P3.1), Ports (J4#3.52)
AD8: Arduino (A1.AD8 P5.8), Ports (J4#3.37)
AD9: Arduino (A1.AD9 P5.7), Ports (J4#3.39)
AD10: Arduino (A1.AD10 P5.6), Ports (J4#3.41)
AD11: Arduino (A1.AD11 P5.5), Ports (J4#3.43)
AD12: Arduino (A1.AD12 P5.4), Ports (J4#3.45)
AD13: Arduino (A1.AD13 P5.3), Ports (J4#3.47)
AD14: Arduino (A1.AD14 P5.2), Ports (J4#3.49)
AD15: Arduino (A1.AD15 P5.1), Ports (J4#3.51)
Button1: Arduino (A1.37), Peripherals (R14.2 SW4.16), Ports (J4#3.20)
Button2: Arduino (A1.36), Peripherals (R14.3 SW4.15), Ports (J4#3.19)
Button3: Arduino (A1.35), Peripherals (R14.4 SW4.14), Ports (J4#3.18)
Button4: Arduino (A1.34), Peripherals (R14.5 SW4.13), Ports (J4#3.17)
Button5: Arduino (A1.33), Peripherals (R14.6 SW4.12), Ports (J4#3.16)
Button6: Arduino (A1.32), Peripherals (R14.7 SW4.11), Ports (J4#3.15)
Button7: Arduino (A1.31), Peripherals (R14.8 SW4.10), Ports (J4#3.14)
Button8: Arduino (A1.30), Peripherals (R14.9 SW4.9), Ports (J4#3.13)
Ch1: Arduino (A1.49), Peripherals (P16.1), Ports (J4#3.32)
Ch2: Arduino (A1.48), Peripherals (P16.2), Ports (J4#3.31)
Ch3: Arduino (A1.47), Peripherals (P16.3), Ports (J4#3.30)
Ch4: Arduino (A1.46), Peripherals (P16.4), Ports (J4#3.29)
Ch5: Arduino (A1.45), Peripherals (P16.5), Ports (J4#3.28)
Ch6: Arduino (A1.44), Peripherals (P16.6), Ports (J4#3.27)
Ch7: Arduino (A1.43), Peripherals (P16.7), Ports (J4#3.26)
Ch8: Arduino (A1.42), Peripherals (P16.8), Ports (J4#3.25)
CTS1: Arduino (A1.7 P4.1), Serial (U1.9)
CTS3: Arduino (A1.9 P1.9), Serial (U2.9)
LED1: Arduino (A1.23), Peripherals (LED1.2), Ports (J4#3.6)
LED2: Arduino (A1.22), Peripherals (LED2.2), Ports (J4#3.5)
LED3: Arduino (A1.25), Peripherals (LED3.2), Ports (J4#3.8)
LED4: Arduino (A1.24), Peripherals (LED4.2), Ports (J4#3.7)
LED5: Arduino (A1.27), Peripherals (LED5.2), Ports (J4#3.10)
LED6: Arduino (A1.26), Peripherals (LED6.2), Ports (J4#3.9)
LED7: Arduino (A1.29), Peripherals (LED7.2), Ports (J4#3.12)
LED8: Arduino (A1.28), Peripherals (LED8.2), Ports (J4#3.11)
PI: Arduino (A1.40), Peripherals (P16.12), Ports (J4#3.23)
PR: Arduino (A1.41), Peripherals (P16.11), Ports (J4#3.24)
Relais1: Arduino (A1.53), Ports (J4#3.36)
Relais2: Arduino (A1.52), Serial (P12.3), Ports (J4#3.35)
Relais3: Arduino (A1.51), Serial (P12.1), Ports (J4#3.34)
Relais4: Arduino (A1.50), Serial (P12.4), Ports (J4#3.33)
Reset: Arduino (A1.RESET P2.6 SW1.2 SW1.4), Serial (P12.5)
RTS1: Arduino (A1.6 P4.2), Serial (U1.10)
RTS3: Arduino (A1.8 P1.10), Serial (U2.10)
RX1: Arduino (A1.16 P6.6), Serial (LED9.2 U1.12)
RX2: Arduino (A1.18 P6.4), Serial (J2.2 LED13.2)
RX3: Arduino (A1.20 P6.2), Serial (LED12.2 U2.12)
SCL: Arduino (A1.14 P6.8), Serial (P11.2)
SDA: Arduino (A1.15 P6.7), Serial (P11.1)
Tactile1: Arduino (A1.38), Peripherals (R9.2 SW2.2 SW2.4), Ports (J4#3.21)
Tactile2: Arduino (A1.39), Peripherals (R10.1 SW3.1 SW3.3), Ports (J4#3.22)
TX1: Arduino (A1.17 P6.5), Serial (LED10.2 U1.11)
TX2: Arduino (A1.19 P6.3), Serial (J3.2 LED14.2)
TX3: Arduino (A1.21 P6.1), Serial (LED11.2 U2.11)